# Altium schematic sheet MOTOR.SchDoc
size A2; SheetNumber: 6; SheetTotal: 9
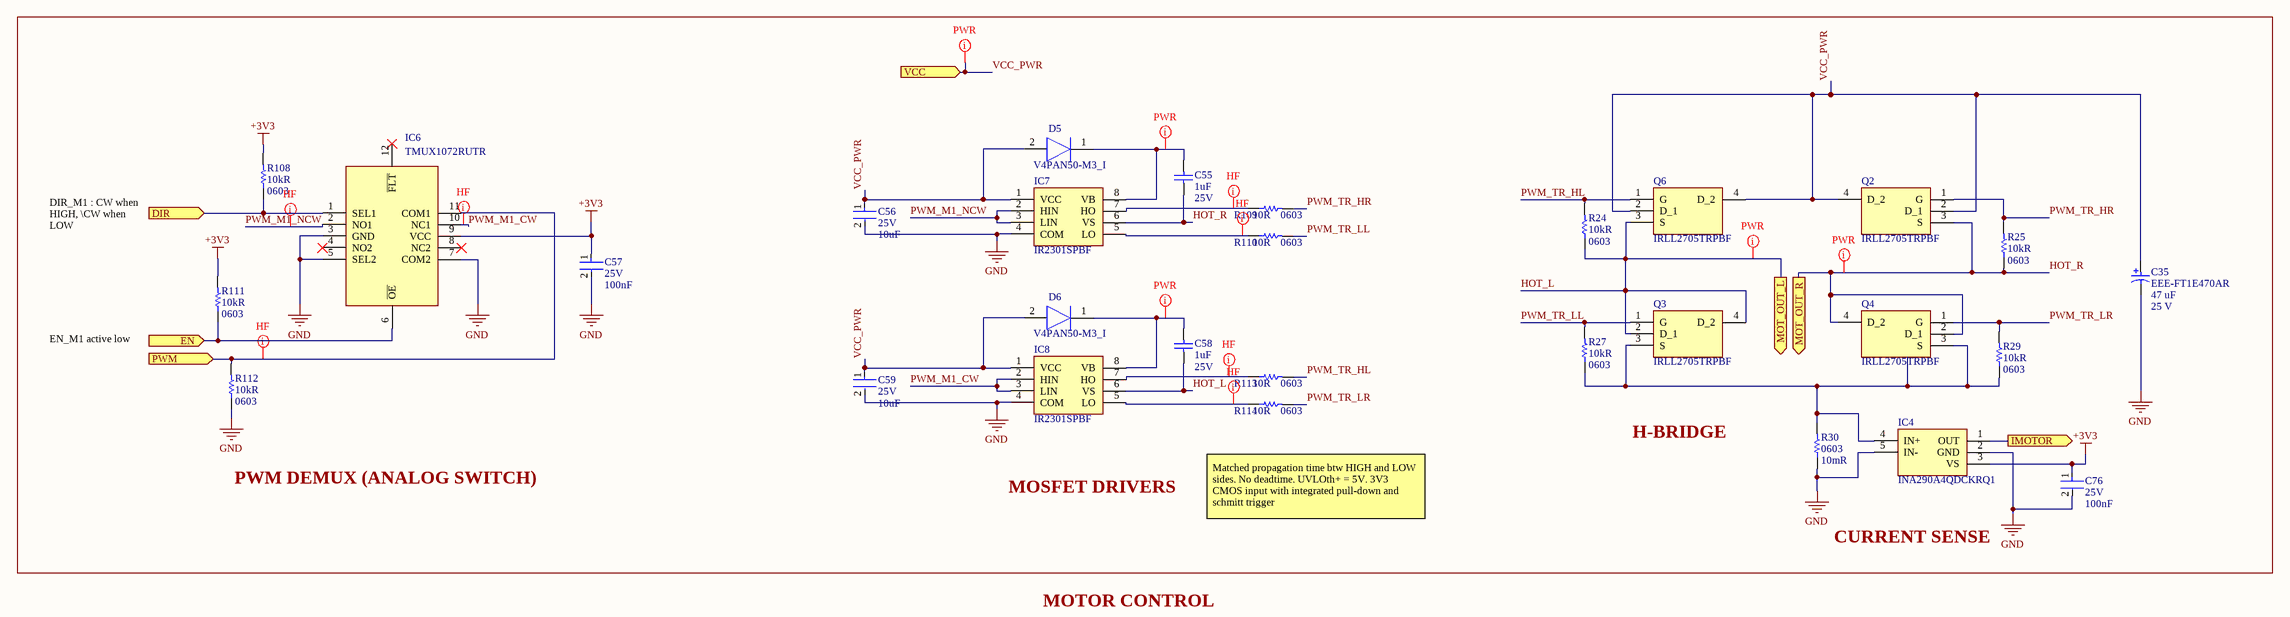
[diagram p0: MOTOR.SchDoc]

## Parts
C35  EEE-FT1E470AR  Cap.: 47 uF  Rated Voltage: 25 V  [PNSC-FT-V-53x53-2_V]
C55  Capacitance: 1uF  Voltage Rating (DC): 25V  [CAPC1608X90X35LL15T15]  (hidden comment: C0603C105K3PAC7867)
C56  Voltage Rating (DC): 25V  Capacitance: 10uF  [FP-C2012-125-0_2-IPC_B]  (hidden comment: C2012X5R1E106K125AB)
C57  Voltage Rating (DC): 25V  Capacitance: 100nF  [FP-CGA3E-0_3-0_1-MFG]  (hidden comment: CGA3E2X7R1E104K080AA)
C58  Capacitance: 1uF  Voltage Rating (DC): 25V  [CAPC1608X90X35LL15T15]  (hidden comment: C0603C105K3PAC7867)
C59  Voltage Rating (DC): 25V  Capacitance: 10uF  [FP-C2012-125-0_2-IPC_B]  (hidden comment: C2012X5R1E106K125AB)
C76  Voltage Rating (DC): 25V  Capacitance: 100nF  [FP-CGA3E-0_3-0_1-MFG]  (hidden comment: CGA3E2X7R1E104K080AA)
D5  V4PAN50-M3_I  [V4PAN50M3I]
D6  V4PAN50-M3_I  [V4PAN50M3I]
IC4  INA290A4QDCKRQ1  [SOT65P210X110-5N]
IC6  TMUX1072RUTR  [QFN40P170X200X55-12N]
IC7  IR2301SPBF  [SOIC127P600X175-8N]
IC8  IR2301SPBF  [SOIC127P600X175-8N]
Q2  IRLL2705TRPBF  [SOT230P700X180-4N]
Q3  IRLL2705TRPBF  [SOT230P700X180-4N]
Q4  IRLL2705TRPBF  [SOT230P700X180-4N]
Q6  IRLL2705TRPBF  [SOT230P700X180-4N]
R24  Resistance: 10kR  Case Code (Imperial): 0603  [RESC1609X55X30LL15T15]  (hidden comment: ERJ3EKF1002V)
R25  Resistance: 10kR  Case Code (Imperial): 0603  [RESC1609X55X30LL15T15]  (hidden comment: ERJ3EKF1002V)
R27  Resistance: 10kR  Case Code (Imperial): 0603  [RESC1609X55X30LL15T15]  (hidden comment: ERJ3EKF1002V)
R29  Resistance: 10kR  Case Code (Imperial): 0603  [RESC1609X55X30LL15T15]  (hidden comment: ERJ3EKF1002V)
R30  Case Code (Imperial): 0603  Resistance: 10mR  [RESC1508X46X38ML25T25]  (hidden comment: WSL0603R0100FEA)
R108  Resistance: 10kR  Case Code (Imperial): 0603  [RESC1609X55X30LL15T15]  (hidden comment: ERJ3EKF1002V)
R109  Case/Package: 0603  Resistance: 10R  [RESC1608X55X25NL10T15]  (hidden comment: RC0603FR-0710RL)
R110  Case/Package: 0603  Resistance: 10R  [RESC1608X55X25NL10T15]  (hidden comment: RC0603FR-0710RL)
R111  Resistance: 10kR  Case Code (Imperial): 0603  [RESC1609X55X30LL15T15]  (hidden comment: ERJ3EKF1002V)
R112  Resistance: 10kR  Case Code (Imperial): 0603  [RESC1609X55X30LL15T15]  (hidden comment: ERJ3EKF1002V)
R113  Case/Package: 0603  Resistance: 10R  [RESC1608X55X25NL10T15]  (hidden comment: RC0603FR-0710RL)
R114  Case/Package: 0603  Resistance: 10R  [RESC1608X55X25NL10T15]  (hidden comment: RC0603FR-0710RL)

## Ports
DIR (in), EN (in), IMOTOR (out), MOT_OUT_L (out), MOT_OUT_R (out), PWM (in), VCC (in)

## Nets
+3V3: C57.1 C76.1 IC4.3(VS) IC6.9(VCC) R108.2 R111.2
GND: C35.2 C56.2 C57.2 C59.2 C76.2 IC4.2(GND) IC4.5(IN-) IC6.3(GND) IC6.5(SEL2) IC6.7(COM2) IC7.4(COM) IC8.4(COM) R30.1 R112.1
DIR: IC6.1(SEL1) R108.1 ; port DIR
EN: IC6.6(~{OE}) R111.1 ; port EN
HOT_L: C58.1 IC8.6(VS) Q3.2(D_1) Q3.4(D_2) Q6.3(S) R24.1 ; port MOT_OUT_L
HOT_R: C55.1 IC7.6(VS) Q2.3(S) Q4.2(D_1) Q4.4(D_2) R25.1 ; port MOT_OUT_R
IMOTOR: IC4.1(OUT) ; port IMOTOR
PWM: IC6.11(COM1) R112.2 ; port PWM
PWM_M1_CW: IC6.10(NC1) IC8.2(HIN) IC8.3(LIN)
PWM_M1_NCW: IC6.2(NO1) IC7.2(HIN) IC7.3(LIN)
PWM_TR_HL: Q6.1(G) R24.2 R113.2
PWM_TR_HR: Q2.1(G) R25.2 R109.2
PWM_TR_LL: Q3.1(G) R27.2 R110.2
PWM_TR_LR: Q4.1(G) R29.2 R114.2
VCC_PWR: C35.1 C56.1 C59.1 D5.2(A) D6.2(A) IC7.1(VCC) IC8.1(VCC) Q2.2(D_1) Q2.4(D_2) Q6.2(D_1) Q6.4(D_2) ; port VCC
NetC55_2: C55.2 D5.1(K) IC7.8(VB)
NetC58_2: C58.2 D6.1(K) IC8.8(VB)
NetIC4_4: IC4.4(IN+) Q3.3(S) Q4.3(S) R27.1 R29.1 R30.2
NetIC7_5: IC7.5(LO) R110.1
NetIC7_7: IC7.7(HO) R109.1
NetIC8_5: IC8.5(LO) R114.1
NetIC8_7: IC8.7(HO) R113.1

Not connected (* = marked no-connect by the designer): IC6 4(NO2)* 8(NC2)* 12(~{FLT})*

## Layout directives
net class PWR: HOT_L, HOT_R, NetC55_2, NetC58_2, VCC_PWR
net class HF: NetIC7_5, NetIC7_7, NetIC8_5, NetIC8_7, PWM, PWM_M1_CW, PWM_M1_NCW

## Notes on the sheet
- DIR_M1 : CW when HIGH, \CW when LOW
- EN_M1 active low
- H-BRIDGE
- PWM DEMUX (ANALOG SWITCH)
- MOSFET DRIVERS
- Matched propagation time btw HIGH and LOW sides. No deadtime. UVLOth+ = 5V. 3V3 CMOS input with integrated pull-down and schmitt trigger
- CURRENT SENSE
- MOTOR CONTROL

## Library data of the parts
C35 = CMP-0744-00003-1: Aluminum Electrolytic Capacitor, 47 uF +/- 20%, 25 V, -55 to 105 degC, 2-Pin 5.3 x 5.3 x 6.1 mm SMD, RoHS, Tape and Reel; Manufacturer: Panasonic; Ripple Current: 240 mA; Capacitance Tolerance: +/- 20%; ComponentLink3Description: Package Specification; RoHS: TRUE; PackageReference: FT-V-53x53-2; PartNumber: EEE-FT1E470AR; DatasheetVersion: Mar-14; Temp. Range: -55 to 105 degC; ComponentLink2URL: http://industrial.panasonic.com/www-data/pdf/ABA0000/ABA0000CE135.pdf; PackageDescription: 2-Pin SMD, Body 5.3 x 5.3 mm, Height 6.1 mm; ComponentLink3URL: http://industrial.panasonic.com/www-data/pdf/ABA0000/ABA0000PE248.pdf; Mounting Technology: Surface Mount; ComponentLink2Description: Datasheet; ComponentLink1URL: http://www.panasonic.com/industrial/electronic-components/; PackageVersion: Feb-14; Packing: Tape and Reel; ComponentLink1Description: Manufacturer URL
C55 C58 = CMP-2006-02216-2: Manufacturer: Kemet; Manufacturer Part Number: C0603C105K3PACTU; Dielectric Material: Ceramic; Tolerance: 10%; Dielectric: X5R; Part Number: C0603C105K3PAC7867; Supplier 1: Mouser; Supplier Part Number 1: 80-C0603C105K3P; RoHS: Yes; Category: Ceramic Capacitors; Stock 1: 10085; Pricing 1: 1=0,30000, 10=0,15600, 50=0,15600, 100=0,09300, 500=0,08200, 1000=0,07300, 4000=0,05700, 10000=0,05700 (USD); Mount: Surface Mount,PCB; Case/Package: 0603; Number of Pins: 2; Case Code (Imperial): 0603; Case Code (Metric): 1608; Contact Plating: Tin,Matte; Min Operating Temperature: -55°C; Max Operating Temperature: 85°C; Packaging: Tape and Reel; Termination: SMD/SMT; Voltage Rating: 25V; Package Quantity: 4000; Voltage: 25V; Series: C0603C; Construction: Flat; Length: 1.6mm; Width: 0.031inch; Height: 0.8mm; Depth: 0.8mm; Thickness: 0.034inch; Radiation Hardening: No; REACH SVHC: No SVHC; RoHS Compliant: Yes; Lead Free: Lead Free; ComponentLink1URL: https://datasheet.ciiva.com/5998/40889-5998745.pdf?src-supplier=Farnell; ComponentLink1Description: https://datasheet.ciiva.com/5998/40889-5998745.pdf?src-supplier=Farnell; ComponentLink2URL: https://datasheet.ciiva.com/28610/1918694-28610792.pdf?src-supplier=Element14; ComponentLink2Description: https://datasheet.ciiva.com/28610/1918694-28610792.pdf?src-supplier=Element14
C56 C59 = CMP-08246-002675-1: Multilayer Ceramic Capacitors 10μF ±10% 25V X5R SMD 0805; Manufacturer: TDK; Packaging: Tape and Reel; Dielectric: X5R; Case/Package: 0805; Lead Free: Lead Free; Dielectric Material: Ceramic; Series: C; Termination: SMD/SMT; Voltage: 25V; Depth: 1.25mm; Max Operating Temperature: 85°C; Resistor Type: Ceramic; Weight: 0.000194oz; Case Code (Metric): 2012; Height: 1.25mm; Mount: Surface Mount; Voltage Rating: 25V; Length: 2mm; REACH SVHC: No SVHC; Min Operating Temperature: -55°C; Case Code (Imperial): 0805; Thickness: 0.057inch; Width: 0.049inch; Tolerance: 10%; Package Quantity: 1; Supplier 1: Mouser; Supplier Part Number 1: 810-C2012X5R1E106K; Manufacturer Part Number: C2012X5R1E106K125AB; RoHS: Yes; Category: Ceramic Capacitors; Stock 1: 75897; Pricing 1: 1=0,34000, 10=0,24100, 50=0,24100, 100=0,14400, 1000=0,09100, 10000=0,08800 (USD); ComponentLink1URL: https://datasheet.ciiva.com/22725/1913358-22725561.pdf?src-supplier=Element14; ComponentLink1Description: https://datasheet.ciiva.com/22725/1913358-22725561.pdf?src-supplier=Element14; ComponentLink2URL: https://datasheet.ciiva.com/16394/general-b11-16394044.pdf?src-supplier=Future+Electronics; ComponentLink2Description: https://datasheet.ciiva.com/16394/general-b11-16394044.pdf?src-supplier=Future+Electronics; ComponentLink3URL: https://datasheet.ciiva.com/24216/mlcc-commercial-general-en-24216237.pdf?src-supplier=Mouser; ComponentLink3Description: https://datasheet.ciiva.com/24216/mlcc-commercial-general-en-24216237.pdf?src-supplier=Mouser
C57 C76 = CMP-08246-002186-1: Cap Ceramic 100nF 25V X7R 10% Pad SMD 0603 +125°C Automotive T/R; Manufacturer: TDK; Composition: Ceramic; Dielectric: X7R; Ratings: AEC-Q200; Length: 1.6mm; REACH SVHC: No SVHC; Width: 0.031inch; Packaging: Tape and Reel; Case/Package: 0603; Height: 0.8mm; Termination: SMD/SMT; Max Operating Temperature: 125°C; Thickness: 0.035inch; Case Code (Metric): 1608; Lead Free: Lead Free; Mount: Surface Mount; Voltage Rating: 25V; Tolerance: 10%; Weight: 7.1E-05oz; Min Operating Temperature: -55°C; Package Quantity: 1; Depth: 0.8mm; Case Code (Imperial): 0603; Supplier 1: Mouser; Supplier Part Number 1: 810-CGA3E2X7R1E104K; Manufacturer Part Number: CGA3E2X7R1E104K080AA; RoHS: Yes; Category: Ceramic Capacitors; Stock 1: 488891; Pricing 1: 1=0,12000, 10=0,05600, 50=0,05600, 100=0,02500, 1000=0,01400, 10000=0,01000 (USD); Series: CGA; Resistor Type: Ceramic; RoHS Compliant: Yes; ComponentLink1URL: https://datasheet.ciiva.com/24220/cga3e2x7r1e104k080aa-265934-24220022.pdf?src-supplier=Mouser; ComponentLink1Description: https://datasheet.ciiva.com/24220/cga3e2x7r1e104k080aa-265934-24220022.pdf?src-supplier=Mouser; ComponentLink2URL: https://datasheet.ciiva.com/22725/1735392-22725638.pdf?src-supplier=Element14; ComponentLink2Description: https://datasheet.ciiva.com/22725/1735392-22725638.pdf?src-supplier=Element14; ComponentLink3URL: https://datasheet.ciiva.com/22725/1735392-22725639.pdf?src-supplier=Element14; ComponentLink3Description: https://datasheet.ciiva.com/22725/1735392-22725639.pdf?src-supplier=Element14; ComponentLink4URL: https://datasheet.ciiva.com/16427/mlccspec-automotive-general-midvoltage-en-16427320.pdf?src-supplier=Future+Electronics; ComponentLink4Description: https://datasheet.ciiva.com/16427/mlccspec-automotive-general-midvoltage-en-16427320.pdf?src-supplier=Future+Electronics; ComponentLink5URL: https://datasheet.ciiva.com/23803/1735392-23803082.pdf?src-supplier=Newark; ComponentLink5Description: https://datasheet.ciiva.com/23803/1735392-23803082.pdf?src-supplier=Newark
D5 D6 = V4PAN50-M3_I: Diode; Manufacturer_Name: Vishay; Manufacturer_Part_Number: V4PAN50-M3/I; Datasheet Link: http://www.farnell.com/datasheets/2158732.pdf; Height: 1mm; Mouser Part Number: 78-V4PAN50-M3/I; Mouser Price/Stock: https://www.mouser.co.uk/ProductDetail/Vishay-General-Semiconductor/V4PAN50-M3-I?qs=r0jnxPZtNpqb%252BFSSnAKIyA%3D%3D; Arrow Part Number: V4PAN50-M3/I; Arrow Price/Stock: https://www.arrow.com/en/products/v4pan50-m3i/vishay?region=nac
IC4 = INA290A4QDCKRQ1: Integrated Circuit; Manufacturer_Name: Texas Instruments; Datasheet Link: https://www.ti.com/lit/gpn/INA290-Q1; Height: 1.1mm; Manufacturer_Part_Number: INA290A4QDCKRQ1; Mouser Part Number: 595-INA290A4QDCKRQ1; Mouser Price/Stock: https://www.mouser.co.uk/ProductDetail/Texas-Instruments/INA290A4QDCKRQ1?qs=eP2BKZSCXI5u8rewO66qig%3D%3D; Arrow Part Number: INA290A4QDCKRQ1; Arrow Price/Stock: https://www.arrow.com/en/products/ina290a4qdckrq1/texas-instruments?region=nac
IC6 = TMUX1072RUTR: Integrated Circuit; Manufacturer_Name: Texas Instruments; Datasheet Link: http://www.ti.com/lit/gpn/tmux1072; Height: 0.55mm; Manufacturer_Part_Number: TMUX1072RUTR; Mouser Part Number: 595-TMUX1072RUTR; Mouser Price/Stock: https://www.mouser.co.uk/ProductDetail/Texas-Instruments/TMUX1072RUTR?qs=w%2Fv1CP2dgqp1ghU2rNl24g%3D%3D; Arrow Part Number: TMUX1072RUTR; Arrow Price/Stock: https://www.arrow.com/en/products/tmux1072rutr/texas-instruments
IC7 IC8 = IR2301SPBF: Integrated Circuit; Manufacturer_Name: Infineon; Datasheet Link: https://www.infineon.com/dgdl/ir2301.pdf?fileId=5546d462533600a4015355c97bb216dc; Height: 1.75mm; Manufacturer_Part_Number: IR2301SPBF; Mouser Part Number: 942-IR2301SPBF; Mouser Price/Stock: https://www.mouser.co.uk/ProductDetail/Infineon-IR/IR2301SPBF?qs=dQmlx5f5cRI9WSlcvq46eg%3D%3D; Arrow Part Number: IR2301SPBF; Arrow Price/Stock: https://www.arrow.com/en/products/ir2301spbf/infineon-technologies-ag
Q2-Q4 Q6 = IRLL2705TRPBF: MOSFET (N-Channel); Manufacturer_Name: Infineon; Datasheet Link: https://ms.componentsearchengine.com/Datasheets/2/IRLL2705TRPBF.pdf; Height: 1.8mm; Manufacturer_Part_Number: IRLL2705TRPBF; Mouser Part Number: 942-IRLL2705TRPBF; Mouser Price/Stock: https://www.mouser.co.uk/ProductDetail/Infineon-IR/IRLL2705TRPBF?qs=9%252BKlkBgLFf1DHv3vNo9CMA%3D%3D; Arrow Part Number: IRLL2705TRPBF; Arrow Price/Stock: https://www.arrow.com/en/products/irll2705trpbf/infineon-technologies-ag
R24 R25 R27 R29 R108 R111 R112 = CMP-1012-00623-3: Chip Resistor, 10 KOhm, +/- 1%, 0.1 W, -55 to 155 degC, 0603 (1608 Metric), RoHS, Tape and Reel; Manufacturer: Panasonic; Manufacturer Part Number: ERJ-3EKF1002V; Voltage Rating: 75V; Power Rating: 100mW; Temperature Coefficient: 100ppm\/degreesC; Case\/Package: 0603; Number of Pins: 2; Package Reference: 603; Depth: 0.8mm; Mount: SurfaceMount; Package Description: 2-Pin Surface Mount Device, Body 1.6 x 0.85 mm; Datasheet Version: 02/2017; Length: 1.6mm; Lead Free: LeadFree; Height: 0.45mm; Number of Terminations: 2; Max Power Dissipation: 100mW; Min Operating Temperature: -55degC; Datasheet URL: https://industrial.panasonic.com/cdbs/www-data/pdf/RDA0000/AOA0000C304.pdf; Termination: SMD/SMT; Case Code (Metric): 1608; Tolerance: 1%; Max Operating Temperature: 155degC; RoHSCompliant: true; Voltage Rating (DC): 75V; Radiation Hardening: No; Packaging: TapeandReel; Composition: ThickFilm; Mounting Technology: SurfaceMount; Manufacturer URL: http://www.panasonic.com/; Width: 0.031inch; REACH SVHC: NoSVHC; Contact Plating: Tin; Military Standard: Not; Package Quantity: 1; Supplier 1: Mouser; Supplier Part Number 1: 667-ERJ-3EKF1002V; RoHS: Yes; Category: Chip SMD Resistors; Stock 1: 20455; Pricing 1: 1=0,10000, 10=0,04000, 50=0,04000, 100=0,01700, 1000=0,00700, 5000=0,00500, 10000=0,00500 (USD); Case/Package: 0603; Size Code: 0603; Resistor Type: Thick Film; Series: ERJ; Resistance Tolerance: 1%; Construction: Rectangular; Features: Automotive AEC-Q200; Technology: THICK FILM; RoHS Compliant: Yes; ComponentLink1URL: https://datasheet.ciiva.com/16511/aoa0000ce2-16511861.pdf?src-supplier=Avnet+Asia; ComponentLink1Description: https://datasheet.ciiva.com/16511/aoa0000ce2-16511861.pdf?src-supplier=Avnet+Asia; ComponentLink2URL: https://datasheet.ciiva.com/46372/1678782-46372725.pdf?src-supplier=Element14; ComponentLink2Description: https://datasheet.ciiva.com/46372/1678782-46372725.pdf?src-supplier=Element14; ComponentLink3URL: https://datasheet.ciiva.com/28514/426256-28514198.pdf?src-supplier=Element14; ComponentLink3Description: https://datasheet.ciiva.com/28514/426256-28514198.pdf?src-supplier=Element14; ComponentLink4URL: https://datasheet.ciiva.com/9194/aoa0000ce2-9194199.pdf?src-supplier=Avnet; ComponentLink4Description: https://datasheet.ciiva.com/9194/aoa0000ce2-9194199.pdf?src-supplier=Avnet; ComponentLink5URL: https://datasheet.ciiva.com/7830/aoa0000ce2-7830729.pdf?src-supplier=Element14; ComponentLink5Description: https://datasheet.ciiva.com/7830/aoa0000ce2-7830729.pdf?src-supplier=Element14; ComponentLink6URL: https://datasheet.ciiva.com/17212/aoa0000ce2-17212105.pdf?src-supplier=Avnet+Europe; ComponentLink6Description: https://datasheet.ciiva.com/17212/aoa0000ce2-17212105.pdf?src-supplier=Avnet+Europe; ComponentLink7URL: https://datasheet.ciiva.com/30208/aoa0000ce2-30208985.pdf?src-supplier=Onlinecomponents.com; ComponentLink7Description: https://datasheet.ciiva.com/30208/aoa0000ce2-30208985.pdf?src-supplier=Onlinecomponents.com; ComponentLink8URL: https://datasheet.ciiva.com/48530/aoa0000ce2-48530988.pdf?src-supplier=Avnet; ComponentLink8Description: https://datasheet.ciiva.com/48530/aoa0000ce2-48530988.pdf?src-supplier=Avnet; ComponentLink9URL: https://datasheet.ciiva.com/24070/aoa0000ce2-24070318.pdf?src-supplier=Mouser; ComponentLink9Description: https://datasheet.ciiva.com/24070/aoa0000ce2-24070318.pdf?src-supplier=Mouser; ComponentLink10URL: https://datasheet.ciiva.com/16759/70260748-16759807.pdf?src-supplier=Allied+Electronics; ComponentLink10Description: https://datasheet.ciiva.com/16759/70260748-16759807.pdf?src-supplier=Allied+Electronics
R30 = CMP-2000-03799-1: Manufacturer: Vishay Dale; Tolerance: 1%; Temperature Coefficient: 75ppm/°C; Power Rating: 100mW; Part Number: WSL0603R0100FEA; Supplier 1: Mouser; Supplier Part Number 1: 71-WSL0603R0100FEA; Manufacturer Part Number: WSL0603R0100FEA; RoHS: No; Category: Chip SMD Resistors; Stock 1: 418; Pricing 1: 1=1,03000, 10=0,76500, 50=0,76500, 100=0,47100, 1000=0,39000, 5000=0,37200, 10000=0,37200 (USD); Case/Package: 0603; Number of Pins: 2; Case Code (Metric): 1608; Weight: 7.1E-05oz; Contact Plating: Tin,Matte; Min Operating Temperature: -65°C; Max Operating Temperature: 170°C; Packaging: Tape and Reel; Resistor Type: Metal Element,Metal Strip; Package Quantity: 1; Number of Terminations: 2; Termination: SMD/SMT; Max Power Dissipation: 100mW; Features: Moisture Resistant; Length: 0.06inch; Width: 0.03inch; Height: 0.33mm; Depth: 0.76mm; Radiation Hardening: No; Lead Free: Lead Free; REACH SVHC: Unknown; ComponentLink1URL: https://datasheet.ciiva.com/7791/1598296-7791987.pdf?src-supplier=Element14; ComponentLink1Description: https://datasheet.ciiva.com/7791/1598296-7791987.pdf?src-supplier=Element14; ComponentLink2URL: https://datasheet.ciiva.com/2482/wsl-2482914.pdf?src-supplier=Digi-Key; ComponentLink2Description: https://datasheet.ciiva.com/2482/wsl-2482914.pdf?src-supplier=Digi-Key; ComponentLink3URL: https://datasheet.ciiva.com/2482/wsl-2482915.pdf?src-supplier=Digi-Key; ComponentLink3Description: https://datasheet.ciiva.com/2482/wsl-2482915.pdf?src-supplier=Digi-Key; ComponentLink4URL: https://datasheet.ciiva.com/2482/wsl-2482916.pdf?src-supplier=Digi-Key; ComponentLink4Description: https://datasheet.ciiva.com/2482/wsl-2482916.pdf?src-supplier=Digi-Key; ComponentLink5URL: https://datasheet.ciiva.com/9049/wsl-9049413.pdf?src-supplier=Avnet; ComponentLink5Description: https://datasheet.ciiva.com/9049/wsl-9049413.pdf?src-supplier=Avnet; ComponentLink6URL: https://datasheet.ciiva.com/5469/wsl-101914-5469241.pdf?src-supplier=Mouser; ComponentLink6Description: https://datasheet.ciiva.com/5469/wsl-101914-5469241.pdf?src-supplier=Mouser; ComponentLink7URL: https://datasheet.ciiva.com/17189/wsl-17189978.pdf?src-supplier=Avnet+Europe; ComponentLink7Description: https://datasheet.ciiva.com/17189/wsl-17189978.pdf?src-supplier=Avnet+Europe; ComponentLink8URL: https://datasheet.ciiva.com/28621/1911169-28621724.pdf?src-supplier=Element14; ComponentLink8Description: https://datasheet.ciiva.com/28621/1911169-28621724.pdf?src-supplier=Element14; ComponentLink9URL: https://datasheet.ciiva.com/16510/wsl-16510141.pdf?src-supplier=Future+Electronics; ComponentLink9Description: https://datasheet.ciiva.com/16510/wsl-16510141.pdf?src-supplier=Future+Electronics; ComponentLink10URL: https://datasheet.ciiva.com/28621/1911169-28621725.pdf?src-supplier=Element14; ComponentLink10Description: https://datasheet.ciiva.com/28621/1911169-28621725.pdf?src-supplier=Element14; ComponentLink11URL: https://datasheet.ciiva.com/16755/70205438-16755071.pdf?src-supplier=Allied+Electronics; ComponentLink11Description: https://datasheet.ciiva.com/16755/70205438-16755071.pdf?src-supplier=Allied+Electronics
R109 R110 R113 R114 = CMP-1659-00008-4: Chip Resistor, 10 Ohm, +/- 1%, 0.1 W, -55 to 155 degC, 0603 (1608 Metric), RoHS, Tape and Reel; Manufacturer: Yageo; Voltage Rating: 50 V; Power Rating: 100mW; Temperature Coefficient: 200ppm/°C; Voltage Rating (DC): 50V; PackageReference: 0603; ComponentLink3Description: Package Specification; Packaging: Tape and Reel; Max Operating Temperature: 155 degC; ComponentLink3URL: http://www.farnell.com/datasheets/443971.pdf; PackageDescription: 2-Pin Surface Mount Device, Body 1.6 x 0.8 mm; ComponentLink1URL: http://www.yageo.com/; Pins: 2; REACH SVHC: No SVHC; RoHSCompliant: true; ComponentLink2URL: http://www.yageo.com/documents/recent/PYu-RC_Group_51_RoHS_L_04.pdf; DatasheetVersion: Rev. 4, 02/2016; Mount: Surface Mount; Package Quantity: 200; Min Operating Temperature: -55 degC; Height: 0.45 mm; Mounting Technology: Surface Mount; ComponentLink1Description: Manufacturer URL; ComponentLink2Description: Datasheet; Length: 1.6 mm; Supplier 1: Mouser; Supplier Part Number 1: 603-RC0603FR-0710RL; Manufacturer Part Number: RC0603FR-0710RL; RoHS: Yes; Category: Chip SMD Resistors; Stock 1: 256429; Pricing 1: 1=0,10000, 10=0,04800, 50=0,04800, 100=0,02000, 1000=0,00800, 5000=0,00600, 10000=0,00400 (USD); Number of Pins: 2; Case Code (Imperial): 0603; Case Code (Metric): 1608; Contact Plating: Tin,Matte; Size Code: 0603; Tolerance: 1%; Termination: SMD/SMT; Resistor Type: Thick Film; Features: Moisture Resistant; Series: RC; Max Power Dissipation: 100mW; Number of Terminations: 2; Resistance Tolerance: 1%; Construction: Rectangular; Technology: THICK FILM; Width: 0.8mm; Depth: 0.8mm; Radiation Hardening: No; Military Standard: Not; RoHS Compliant: Yes; Lead Free: Lead Free; ComponentLink4URL: https://datasheet.ciiva.com/11808/0900766b80f96399-11808140.pdf?src-supplier=RSComponents; ComponentLink4Description: https://datasheet.ciiva.com/11808/0900766b80f96399-11808140.pdf?src-supplier=RSComponents; ComponentLink5URL: https://datasheet.ciiva.com/7746/443971-7746245.pdf?src-supplier=Element14; ComponentLink5Description: https://datasheet.ciiva.com/7746/443971-7746245.pdf?src-supplier=Element14; ComponentLink6URL: https://datasheet.ciiva.com/8891/pyu-rc0603-51-rohs-l-4-8891285.pdf?src-supplier=Avnet; ComponentLink6Description: https://datasheet.ciiva.com/8891/pyu-rc0603-51-rohs-l-4-8891285.pdf?src-supplier=Avnet; ComponentLink7URL: https://datasheet.ciiva.com/28386/pyu-rc0603-51-rohs-l-4-28386637.pdf?src-supplier=Avnet+Europe; ComponentLink7Description: https://datasheet.ciiva.com/28386/pyu-rc0603-51-rohs-l-4-28386637.pdf?src-supplier=Avnet+Europe